# EasyEDA Pro project TuoZhanBan_v2.0.eprj

# Schematic TuoZhanBan_v2.0
Create Date: 2023-11-08; Page Name: P1; Project Name: TuoZhanBan_v2.0; Schematic Name: Schematic1; Update Date: 2023-11-08; Company: 嘉立创EDA; Page Size: A4; Version: V2.0
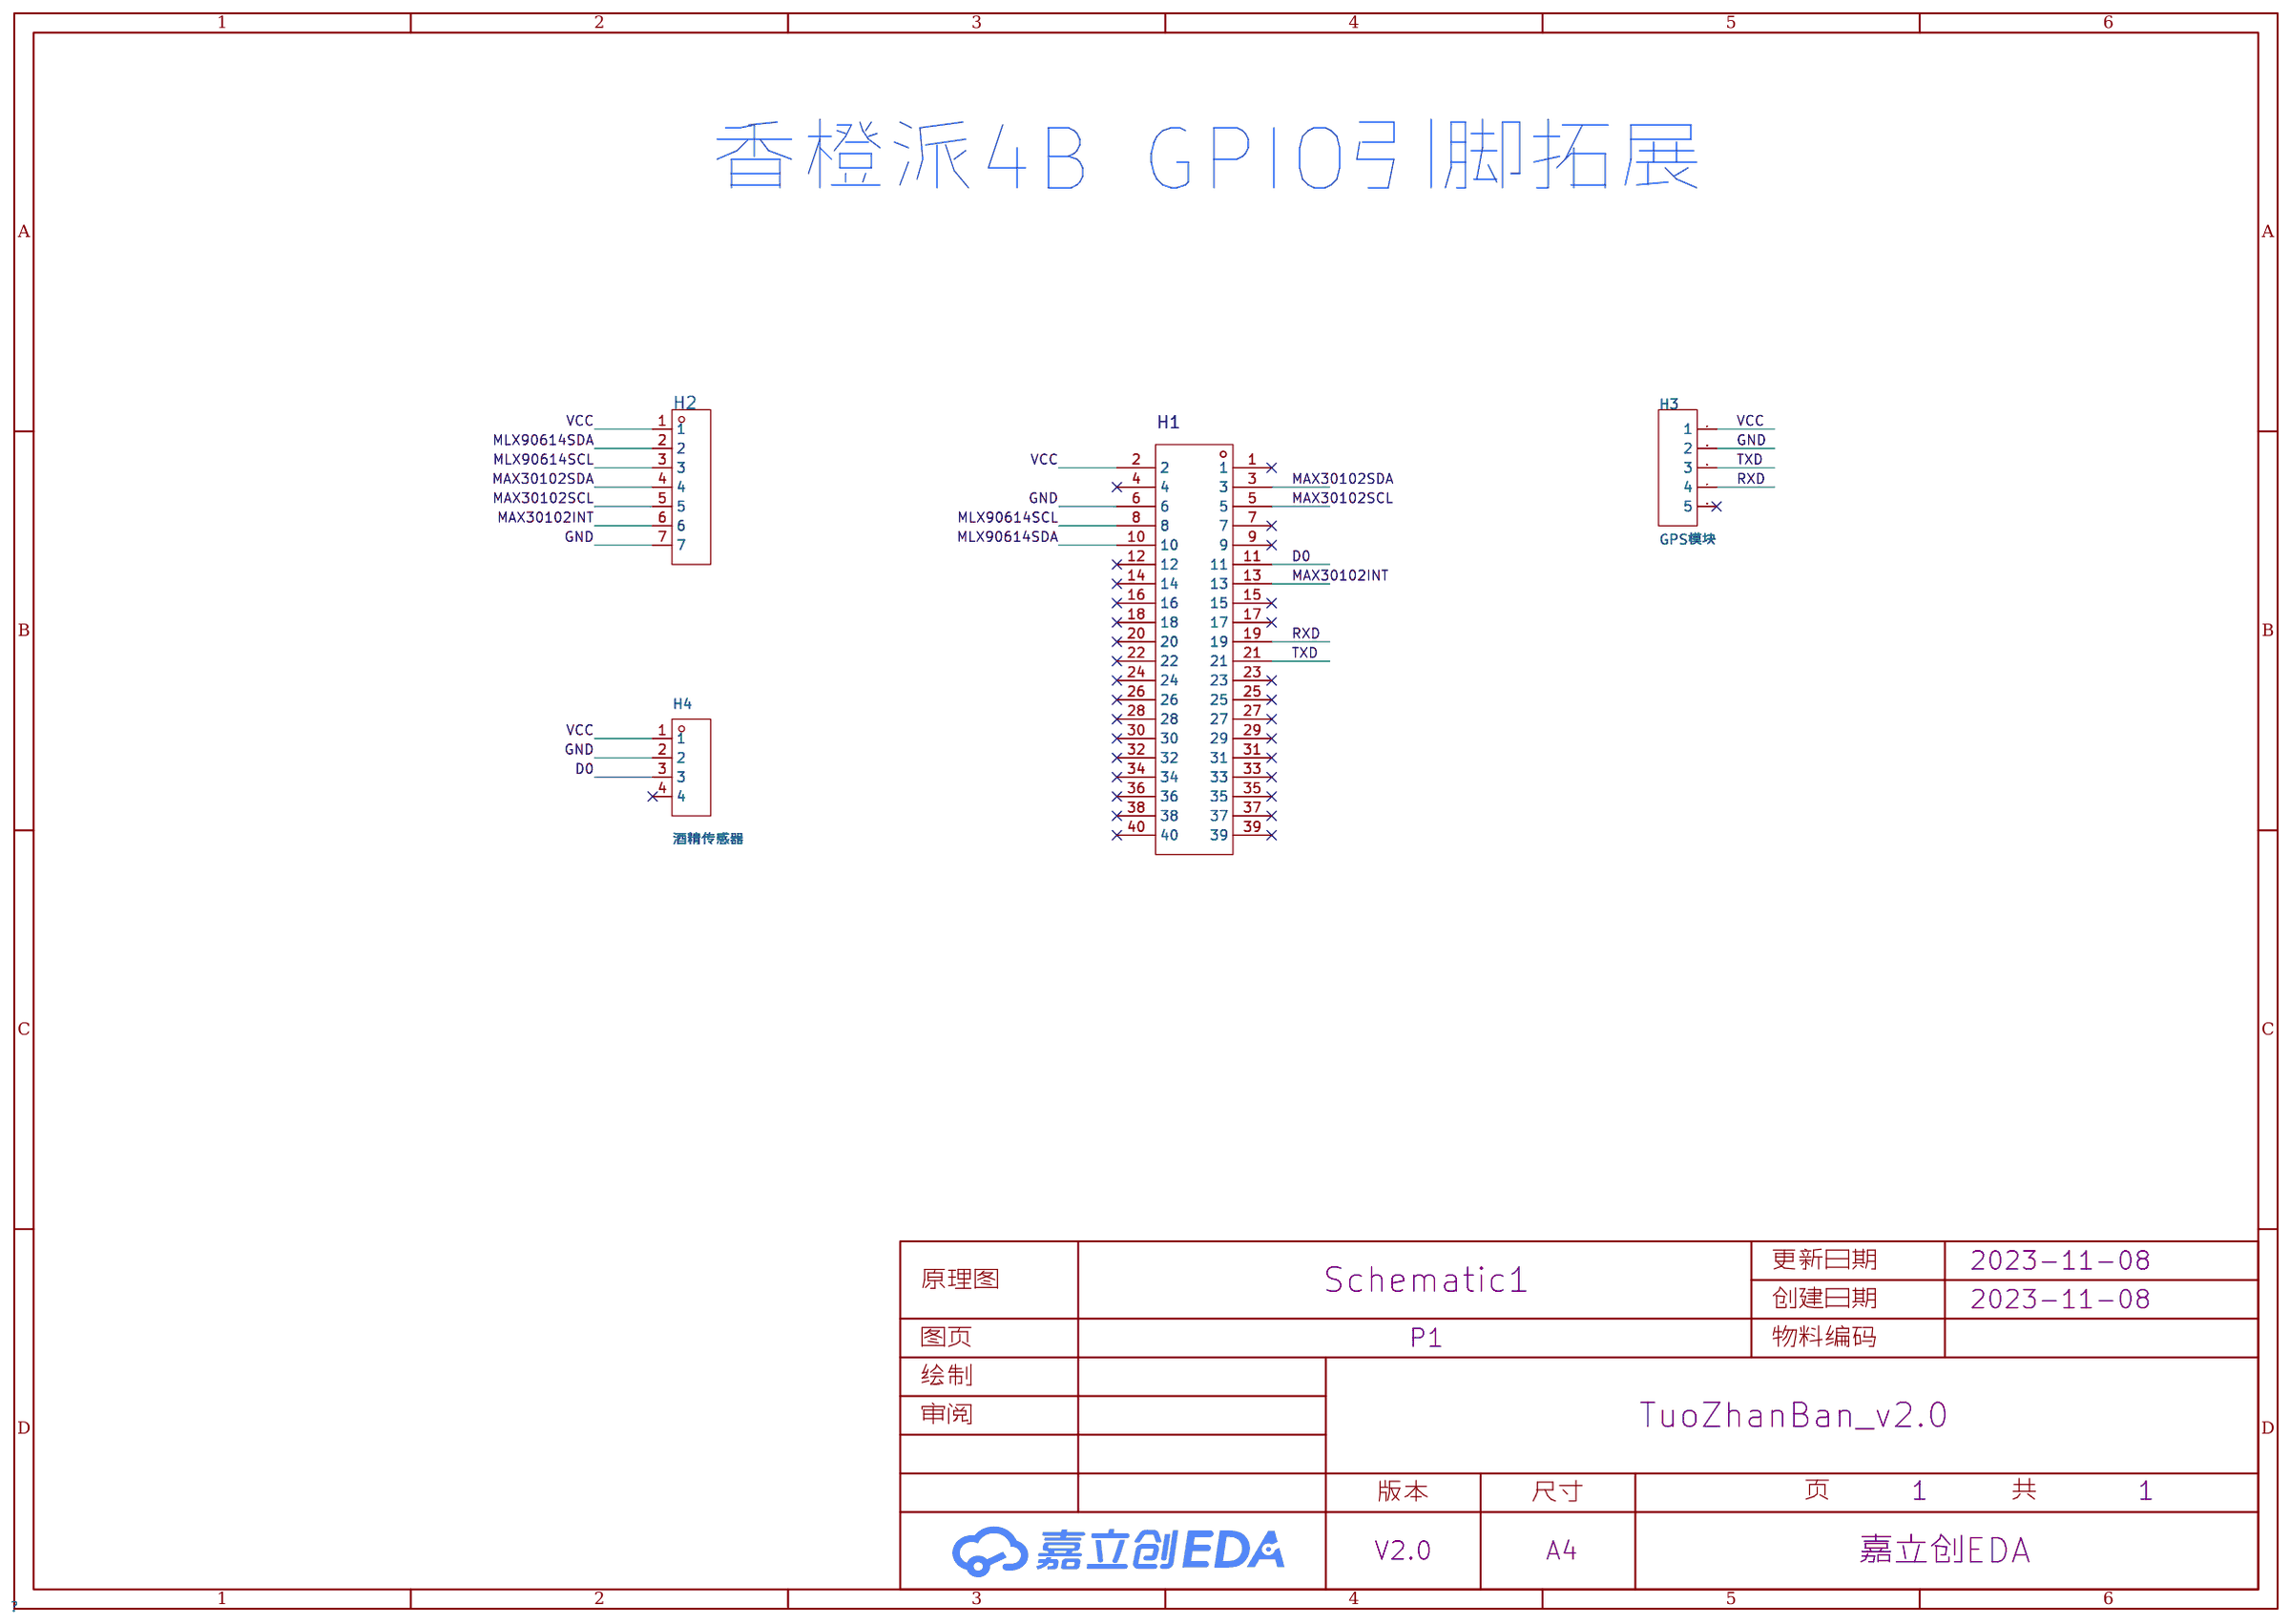
[diagram p0: schematic sheet]

## Parts
H1  B-2100S40P-B110  [HDR-TH_40P-P2.54-V-M-R2-C20-S2.54]
H2  PZ254V-11-07P  [HDR-TH_7P-P2.54-V-M]
H3  GPS模块  [HDR-TH_5P-P2.54-V-F]
H4  酒精传感器  [HDR-TH_4P-P2.54-V-F]

## Library data of the parts
H1 = B-2100S40P-B110: 排数:双排;总PIN位数:40;间距:2.54mm;插针结构:2x20P;行距:2.54mm;安装类型:直插;圆针/方针:-;额定电流:-;额定电压:-;配合针长度:6mm;塑高:2.54mm;端接针长度:3mm;触头材质:黄铜;触头镀层:-;工作温度范围:-40℃~+105℃;颜色:黑色;; LCSC Part Name: 2.54mm 2x20P 直插; Supplier Part: C124383; Manufacturer: Ckmtw(灿科盟); Supplier Footprint: 直插,P=2.54mm; JLCPCB Part Class: 扩展库; Supplier: LCSC; Number of Rows: 双排; Number of Pins: 40; Pitch: 2.54mm; Pin Structure: 2x20P; Row Spacing: 2.54mm; Mounting Type: 直插; Length of Mating Pin: 6mm; Insulation Height: 2.54mm; Length of End Connection Pin: 3mm; Contact Material: 黄铜; Operating Temperature Range: -40℃~+105℃; Color: 黑色
H2 = PZ254V-11-07P: 排数:单排;总PIN位数:7P;间距:2.54mm;插针结构:1x7P;行距:-;安装类型:直插;圆针/方针:方针;额定电流:-;额定电压:-;配合针长度:6mm;塑高:2.5mm;端接针长度:3mm;触头材质:黄铜;触头镀层:-;工作温度范围:-40℃~+105℃;颜色:黑色;; LCSC Part Name: 2.54mm 1x7P 直插 方针; Supplier Part: C492406; Manufacturer: XFCN(兴飞); Supplier Footprint: 插件,P=2.54mm; JLCPCB Part Class: 扩展库; Datasheet: https://atta.szlcsc.com/upload/public/pdf/source/20200309/C492406_654C533EE691117E22DD9F76C114C2D9.pdf; Supplier: LCSC; Number of Rows: 单排; Number of Pins: 7P; Pitch: 2.54mm; Pin Structure: 1x7P; Mounting Type: 直插; Circluar Pins/Square Pins: 方针; Length of Mating Pin: 6mm; Insulation Height: 2.5mm; Length of End Connection Pin: 3mm; Contact Material: 黄铜; Operating Temperature Range: -40℃~+105℃; Color: 黑色
H3 = 2.54-1*5P母: 排数:单排;总孔位数:5P;间距:2.54mm;插孔结构:1x5P;行距:-;安装类型:直插;塑高:-;触头材质:-;触头镀层:-;; LCSC Part Name: 间距:2.54mm 1x5P 直插; Supplier Part: C50950; Manufacturer: BOOMELE(博穆精密); Supplier Footprint: 插件,P=2.54mm; JLCPCB Part Class: Extended Part; Datasheet: https://atta.szlcsc.com/upload/public/pdf/source/20210301/C2718488_F4427B881E42CAA8DDB0B1C12B3A522C.pdf; Supplier: LCSC; Number of Rows: 单排; Number of Holes: 5P; Pitch: 2.54mm; Holes Structure: 1x5P; Mounting Type: 直插
H4 = 2.54-1*4P母: 排数:单排;总孔位数:4P;间距:2.54mm;插孔结构:1x4P;行距:-;安装类型:直插;圆孔/方孔:方孔;额定电流:3A;额定电压:-;插孔方向:顶部;塑高:-;触头材质:青铜;触头镀层:-;工作温度范围:-40℃~+105℃;焊接温度(最大值):-;; LCSC Part Name: 间距:2.54mm 1x4P 直插; Supplier Part: C2718488; Manufacturer: BOOMELE(博穆精密); Supplier Footprint: 插件,P=2.54mm; JLCPCB Part Class: 扩展库; Datasheet: https://atta.szlcsc.com/upload/public/pdf/source/20210301/C2718488_F4427B881E42CAA8DDB0B1C12B3A522C.pdf; Supplier: LCSC; Number of Rows: 单排; Number of Holes: 4P; Pitch: 2.54mm; Holes Structure: 1x4P; Mounting Type: 直插; Circular Hole / Square Hole: 方孔; Current Rating (Max): 3A; Holes Direction: 顶部; Contact Material: 青铜; Operating Temperature Range: -40℃~+105℃

## Nets
GND: H1.6 H2.7 H3.2 H4.2
VCC: H1.2 H2.1 H3.1 H4.1
D0: H1.11 H4.3
MAX30102INT: H1.13 H2.6
MAX30102SCL: H1.5 H2.5
MAX30102SDA: H1.3 H2.4
MLX90614SCL: H1.8 H2.3
MLX90614SDA: H1.10 H2.2
RXD: H1.19 H3.4
TXD: H1.21 H3.3

Not connected (* = marked no-connect by the designer): H1 1* 4* 7* 9* 12* 14* 15* 16* 17* 18* 20* 22* 23* 24* 25* 26* 27* 28* 29* 30* 31* 32* 33* 34* 35* 36* 37* 38* 39* 40*; H3 5*; H4 4*

## Notes on the sheet
- 香橙派4B GPIO引脚拓展

# Board PCB1
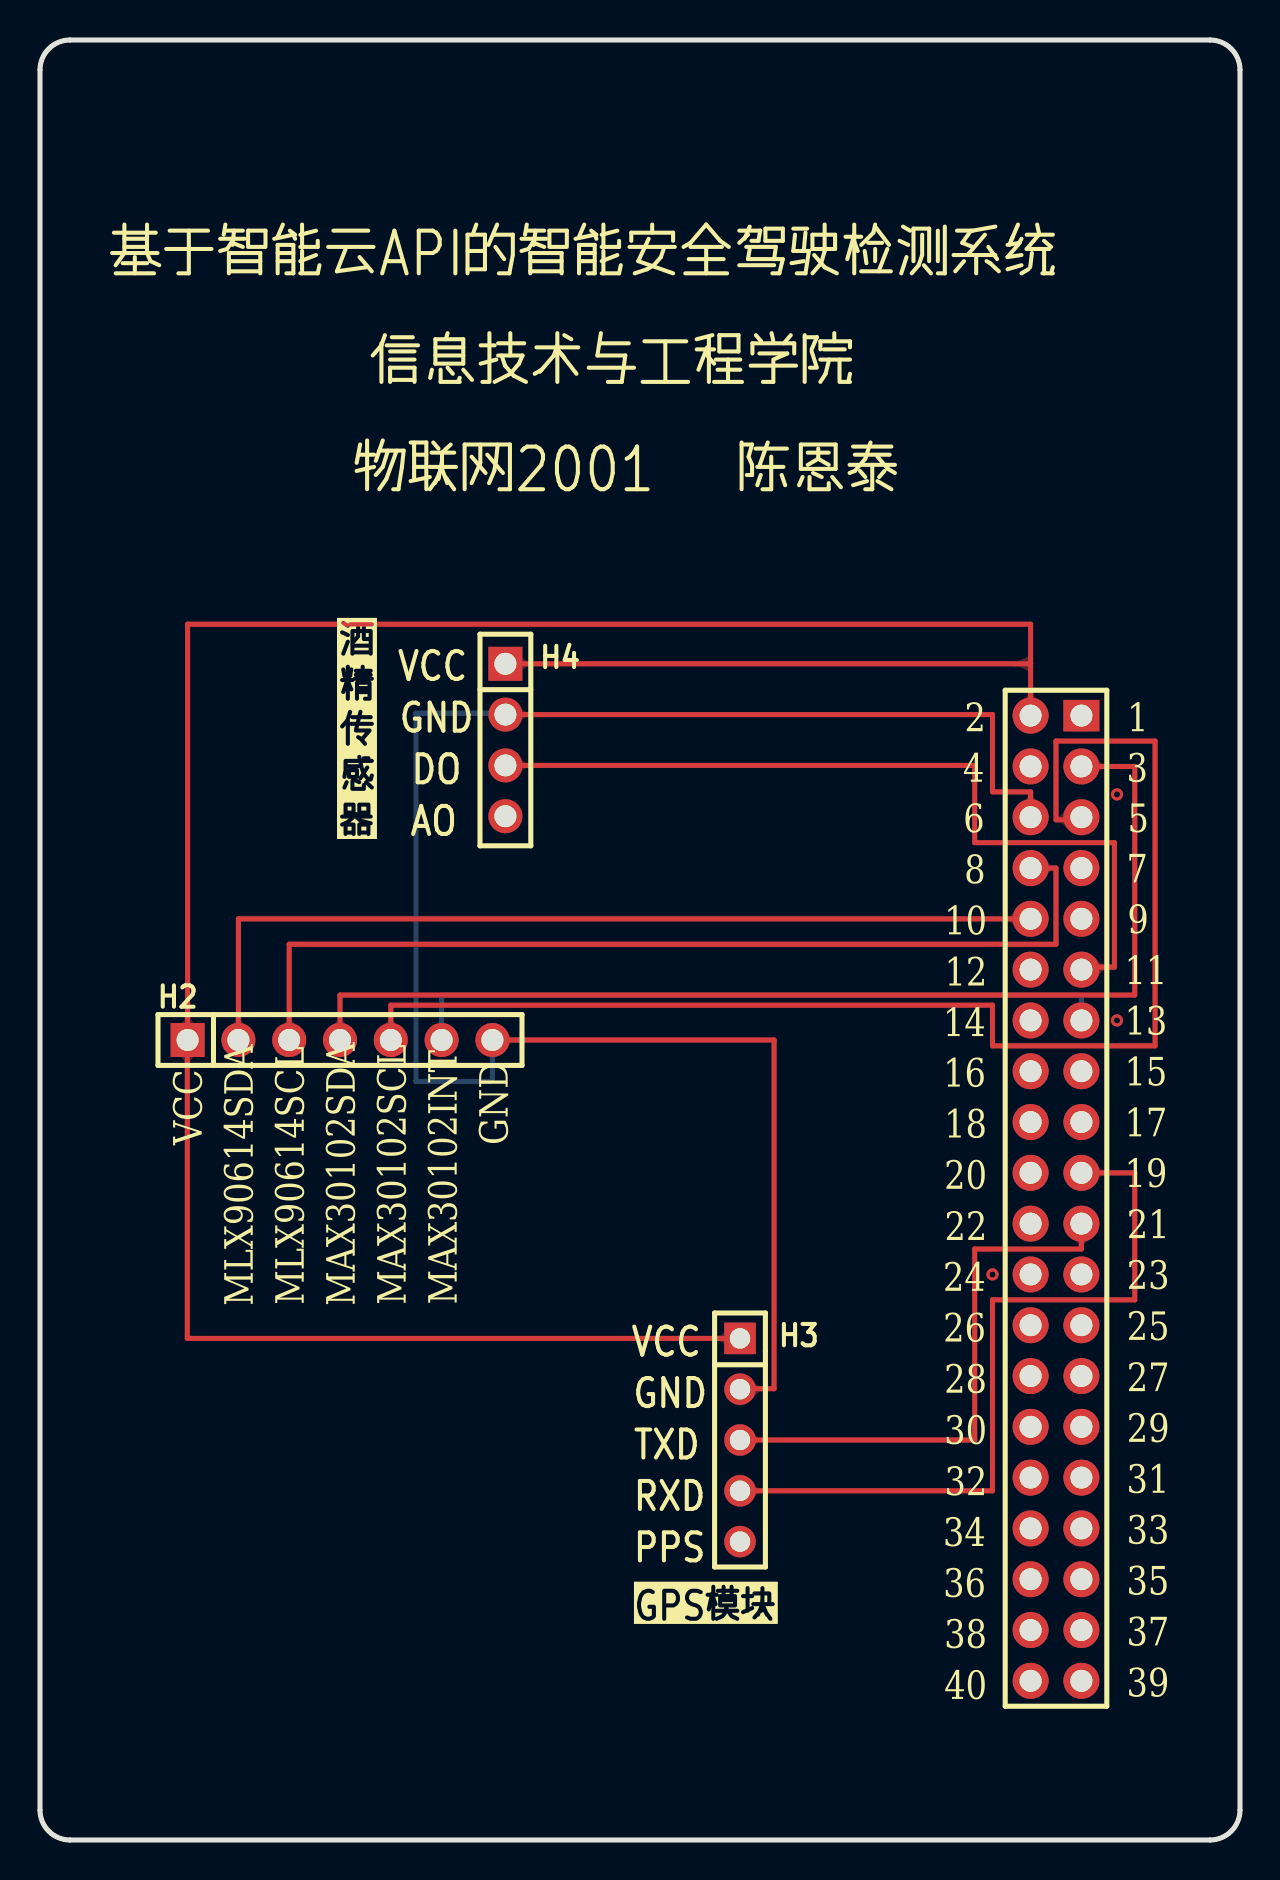
[diagram p1: board, top side]
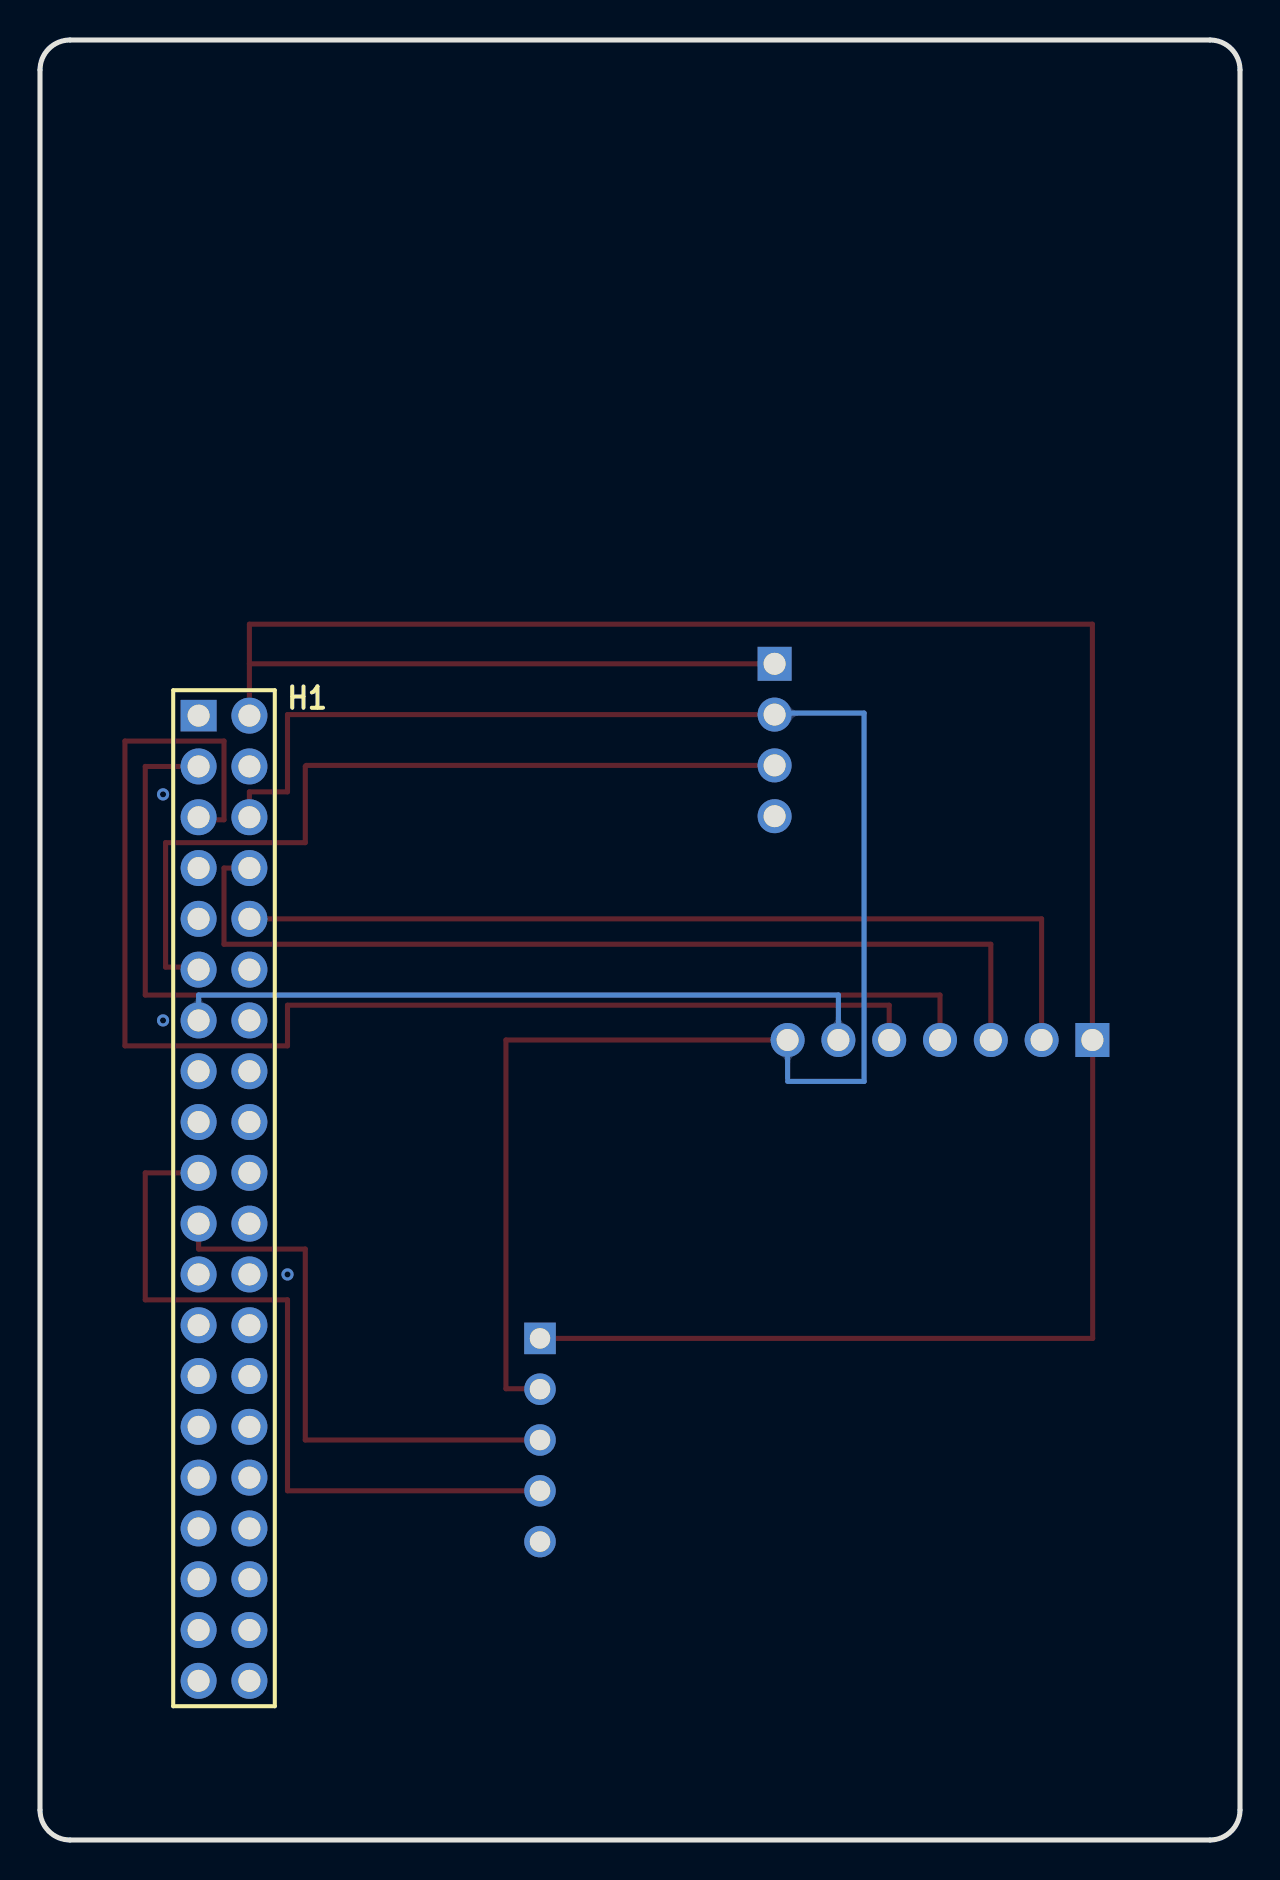
[diagram p2: board, bottom side, seen from below]

Outline 60 x 90 mm; copper layers: Top Layer, Bottom Layer. Coordinates in mm from the lower left corner of the outline.
Outline path: 0,88.5 0,1.5 arc(0.44,0.44) 1.5,0 58.5,0 arc(59.56,0.44) 60,1.5 60,88.5 arc(59.56,89.56) 58.5,90 1.5,90 arc(0.44,89.56) 0,88.5
Stack: Top Layer 0.035mm / Dielectric1 1.51mm FR4 er 4.5 / Bottom Layer 0.035mm

## Design rules (mm)
template: JLCPCB Capability(Two Layers Board)
spacing copperThickness1oz (default): track to track 0.102, other pairs 0.152 to 0.3
spacing copperThickness2oz: track to track 0.203, other pairs 0.152 to 0.3
track width copperThickness1oz (default): min 0.127, default 0.254, max 2.54
track width copperThickness2oz: min 0.203, default 0.254, max 2.54
differential pair differentialPair (default): width min 0.127, default 0.254, max 2.54; gap min 0.152, default 0.152
via viaSize (default): diameter min 0.5, default 0.61, max 10; hole min 0.3, default 0.305, max 6.3

## Placement (name value [footprint] x y rotation side)
H1  B-2100S40P-B110  [HDR-TH_40P-P2.54-V-M-R2-C20-S2.54]  50.8 32.09 270 bottom
H2  PZ254V-11-07P  [HDR-TH_7P-P2.54-V-M]  15 40 0 top
H3  GPS模块  [HDR-TH_5P-P2.54-V-F]  35 20 270 top
H4  酒精传感器  [HDR-TH_4P-P2.54-V-F]  23.27 55 270 top

## Footprints (pads in the part's own frame, mm; a bottom-side part is the same pattern mirrored in y, then rotated)
HDR-TH_4P-P2.54-V-F
  rect 1.7x1.7 hole 1.1: 1(-3.81,0)
  round 1.7 hole 1.1: 2(-1.27,0) 3(1.27,0) 4(3.81,0)
HDR-TH_5P-P2.54-V-F
  rect 1.575x1.575 hole 1.02: 1(-5.08,0)
  round 1.575 hole 1.02: 2(-2.54,0) 3(0,0) 4(2.54,0) 5(5.08,0)
HDR-TH_7P-P2.54-V-M
  rect 1.7x1.7 hole 1.1: 1(-7.62,0)
  round 1.7 hole 1.1: 2(-5.08,0) 3(-2.54,0) 4(0,0) 5(2.54,0) 6(5.08,0) 7(7.62,0)
HDR-TH_40P-P2.54-V-M-R2-C20-S2.54
  rect 1.575x1.8 hole 1.1: 1(-24.13,-1.27)
  round 1.8 hole 1.1: 2(-24.13,1.27) 3(-21.59,-1.27) 4(-21.59,1.27) 5(-19.05,-1.27) 6(-19.05,1.27) 7(-16.51,-1.27) 8(-16.51,1.27) 9(-13.97,-1.27) 10(-13.97,1.27) 11(-11.43,-1.27) 12(-11.43,1.27) 13(-8.89,-1.27) 14(-8.89,1.27) 15(-6.35,-1.27) 16(-6.35,1.27) 17(-3.81,-1.27) 18(-3.81,1.27) 19(-1.27,-1.27) 20(-1.27,1.27) 21(1.27,-1.27) 22(1.27,1.27) 23(3.81,-1.27) 24(3.81,1.27) 25(6.35,-1.27) 26(6.35,1.27) 27(8.89,-1.27) 28(8.89,1.27) 29(11.43,-1.27) 30(11.43,1.27) 31(13.97,-1.27) 32(13.97,1.27) 33(16.51,-1.27) 34(16.51,1.27) 35(19.05,-1.27) 36(19.05,1.27) 37(21.59,-1.27) 38(21.59,1.27) 39(24.13,-1.27) 40(24.13,1.27)

## Nets
As in the schematic.

Pads without a net: H1 1 4 7 9 12 14 15 16 17 18 20 22 23 24 25 26 27 28 29 30 31 32 33 34 35 36 37 38 39 40; H3 5; H4 4

## Via types
v1: diameter 0.61, hole 0.305, Top Layer to Bottom Layer, 9 vias

## Routing (per net, layer and track width the routed paths; a pad name or vN(x,y) marks a point on that pad's centre or on a via; arc(x,y) is an arc through that point)
GND: length 93.3
  Top Layer w0.254: v1(22.62,40) 36.7,40 36.7,22.56 35.02,22.56 H3.2 ; v1(23.27,56.27) 47.62,56.27 47.62,52.41 49.53,52.41 v1(49.53,51.14)
  Bottom Layer w0.254: 22.62,37.93 18.8,37.93 18.8,56.34 23.19,56.34 v1(23.27,56.27) ; v1(22.62,40) 22.62,38.07
  vias: v1(47.62,28.28) v1(53.85,52.28) v1(53.85,40.98)
VCC: length 136.3
  Top Layer w0.254: H4.1 49.53,58.81 ; 49.53,58.81 H1.2 ; 49.53,58.81 49.53,60.79 7.38,60.79 v1(7.38,40) 7.37,39.99 7.37,25.08 H3.1
D0: length 42.2
  Top Layer w0.254: H4.3 46.68,53.73 46.74,53.68 46.74,49.87 53.72,49.87 53.72,43.64 52.2,43.64 H1.11
MAX30102INT: length 35.5
  Bottom Layer w0.254: H2.6 20.08,42.25 52.07,42.25 v1(52.07,40.98)
MAX30102SCL: length 67.4
  Top Layer w0.254: H1.5 51.94,51.01 50.8,51.01 50.8,54.95 55.75,54.95 55.75,39.71 47.62,39.71 47.62,41.74 17.54,41.74 H2.5
MAX30102SDA: length 56.1
  Top Layer w0.254: H2.4 15,42.25 54.74,42.25 54.74,53.68 H1.3
MLX90614SCL: length 48.2
  Top Layer w0.254: H1.8 50.8,48.6 50.8,44.79 12.46,44.79 H2.3
MLX90614SDA: length 45.7
  Top Layer w0.254: H1.10 9.92,46.06 H2.2
RXD: length 38.3
  Top Layer w0.254: H3.4 47.62,17.46 47.62,27.01 54.74,27.01 54.74,33.36 H1.19
TXD: length 27.9
  Top Layer w0.254: H3.3 46.74,20 46.74,29.55 52.07,29.55 H1.21

## Copper pours and planes (outline as drawn; the poured copper is in the pictures)
GND on Top Layer: -2.29,92.67 62.61,92.67 62.61,-2.71 -2.29,-2.71
GND on Bottom Layer: -2.03,93.17 62.48,93.17 62.48,-2.84 -2.03,-2.84

Small or netless copper shapes (teardrops, artwork), in the pictures only: 30 on Top Layer, 8 on Bottom Layer

## Text on the board
Top Silkscreen Layer: VCC | GND | AO | DO | TXD | RXD | PPS | 酒 / 精 / 传 / 感 / 器 | GPS模块 | 14 | 24 | 34 | 16 | 26 | 36 | 10 | 18 | 20 | 28 | 30 | 38 | 40 | 12 | 22 | 32 | 4 | 6 | 8 | 2 | 11 | 13 | 15 | 17 | 19 | 7 | 3 | 31 | 33 | 35 | 37 | 39 | 21 | 23 | 25 | 27 | 29 | 1 | 9 | 5 | MLX90614SDA | MLX90614SCL | MAX30102SDA | MAX30102SCL | MAX30102INT | 基于智能云API的智能安全驾驶检测系统 | 物联网2001   陈恩泰 | 信息技术与工程学院
